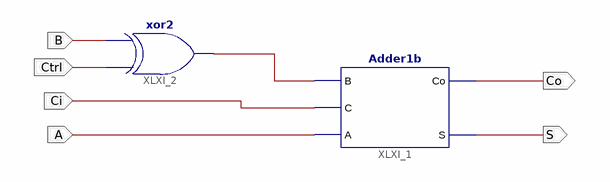
[diagram p0: schematic sheet 1]
// Xilinx ISE schematic AddSub1b.sch (kintex7) as structural Verilog: 2 symbols, 6 ports
module AddSub1b (
  input  A,
  input  Ci,
  input  B,
  input  Ctrl,
  output Co,
  output S
);

  wire XLXN_2;

  Adder1b XLXI_1 (.B(XLXN_2), .C(Ci), .A(A), .Co(Co), .S(S));
  xor XLXI_2 (XLXN_2, Ctrl, B);
endmodule
